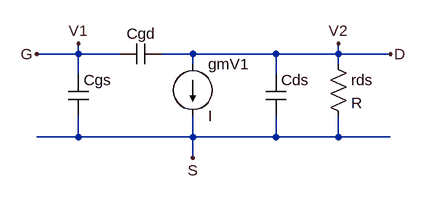
[diagram p0: schematic circuito_eq_bs170.asc]
circuito_eq_bs170.asc, the LTspice schematic file:
Version 4.1
SHEET 1 1220 680
WIRE 704 96 704 80
WIRE 704 96 640 96
WIRE 768 96 704 96
WIRE 880 96 832 96
WIRE 1008 96 880 96
WIRE 1104 96 1104 80
WIRE 1104 96 1008 96
WIRE 1184 96 1104 96
WIRE 880 112 880 96
WIRE 1104 112 1104 96
WIRE 704 128 704 96
WIRE 1008 128 1008 96
WIRE 704 224 704 192
WIRE 704 224 640 224
WIRE 880 224 880 192
WIRE 880 224 704 224
WIRE 1008 224 1008 192
WIRE 1008 224 880 224
WIRE 1104 224 1104 192
WIRE 1104 224 1008 224
WIRE 1184 224 1104 224
WIRE 880 256 880 224
FLAG 1184 96 D
FLAG 640 96 G
FLAG 880 256 S
FLAG 704 80 V1
FLAG 1104 80 V2
SYMBOL cap 688 128 R0
SYMATTR InstName Cgs
SYMATTR Value ""
SYMBOL cap 832 80 R90
WINDOW 0 0 32 VBottom 2
WINDOW 3 32 32 VTop 2
SYMATTR InstName Cgd
SYMATTR Value ""
SYMBOL current 880 112 R0
SYMATTR InstName gmV1
SYMBOL cap 992 128 R0
SYMATTR InstName Cds
SYMATTR Value ""
SYMBOL res 1088 96 R0
SYMATTR InstName rds

The netlist it stands for:
* circuito_eq_bs170.asc
Cgs V1 S
Cgd V2 V1
I§gmV1 V2 S I
Cds V2 S
rds V2 S R
.backanno
.end